# Altium project 16x16_BLE.PrjPcb
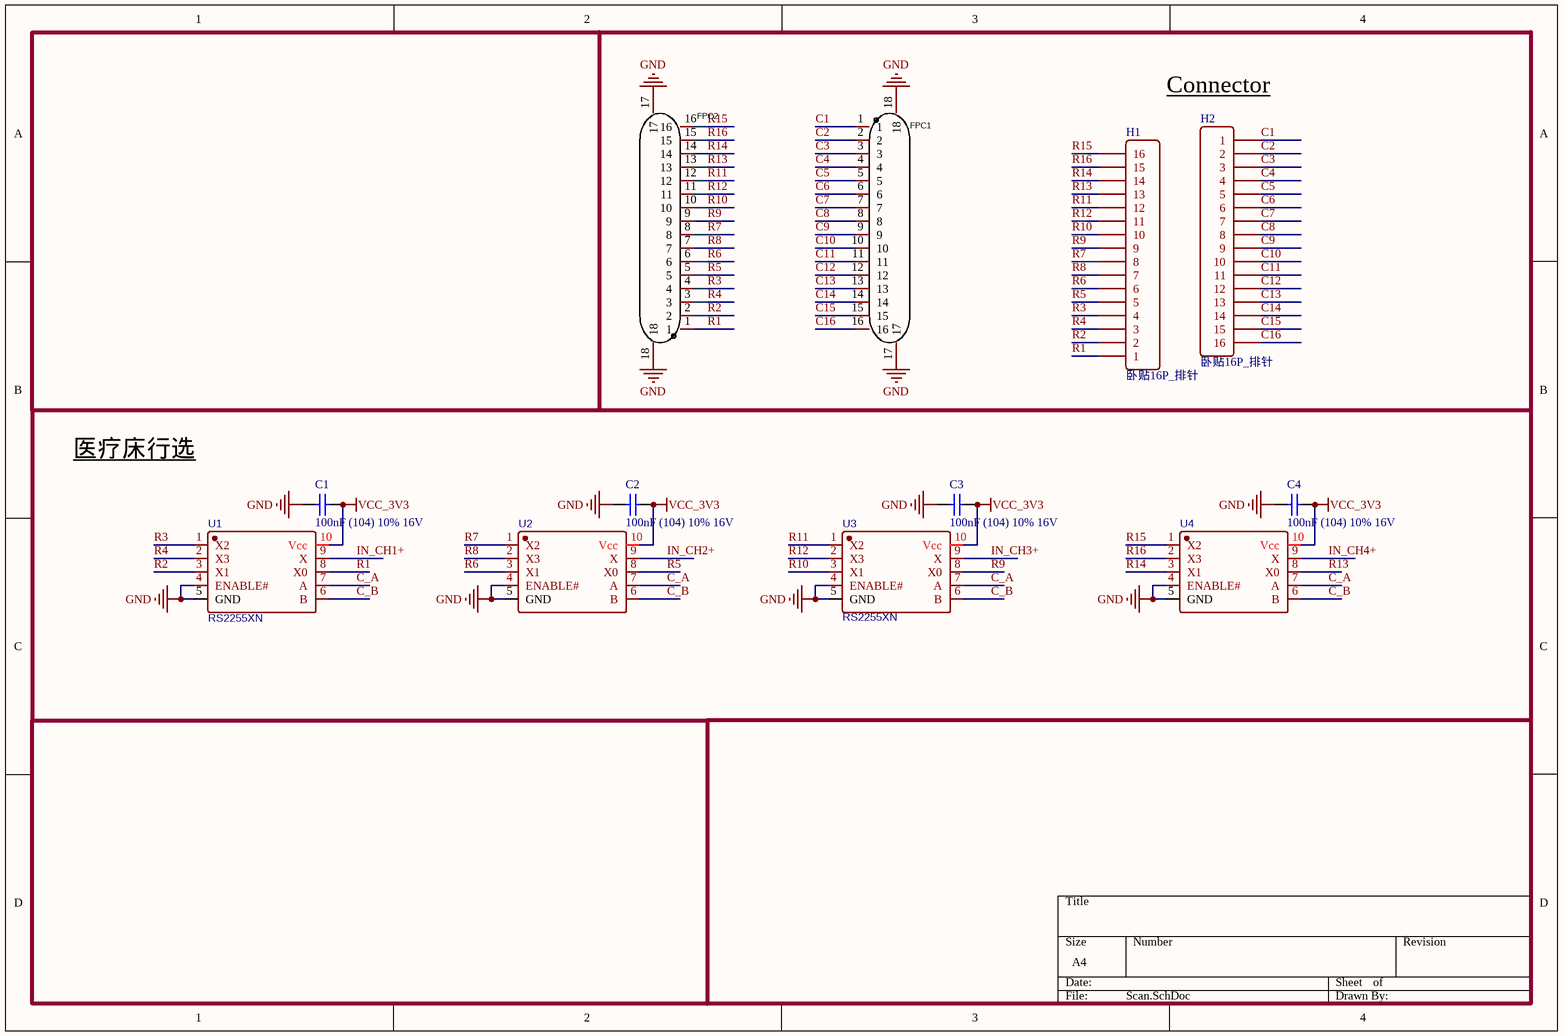
[diagram p0: Scan.SchDoc]
4 sheets, 101 parts. Net scope: global (net labels, ports and power ports of the same name join across sheets).
Board files: 16x16_ble.PcbDoc, 16X16_covert Board.PcbDoc
Sheets:
  Scan.SchDoc
  MCU.SchDoc
  Power.SchDoc
  Measure.SchDoc

## Sheet Scan.SchDoc
size A4

### Parts
C1  100nF (104) 10% 16V  [0402_C]
C2  100nF (104) 10% 16V  [0402_C]
C3  100nF (104) 10% 16V  [0402_C]
C4  100nF (104) 10% 16V  [0402_C]
FPC1  1.0K-FX-16PWB  [FPC-SMD_16P-P1.00-HDGC_1.0K-FX-16PWB]  (value not drawn)
FPC2  X10B25U16T  [FPC-SMD_X10B25U16T]  (value not drawn)
H1  卧贴16P_排针  [CONN-SMD_16PINS]
H2  卧贴16P_排针  [CONN-SMD_16PINS]
U1  RS2255XN  [MSOP-10_L3.0-W3.0-P0.50-LS5.0-BL]
U2  (no value)  [MSOP-10_L3.0-W3.0-P0.50-LS5.0-BL]
U3  RS2255XN  [MSOP-10_L3.0-W3.0-P0.50-LS5.0-BL]
U4  (no value)  [MSOP-10_L3.0-W3.0-P0.50-LS5.0-BL]

### Nets
GND: C1.2 C2.2 C3.2 C4.2 FPC1.17 FPC1.18 FPC2.17 FPC2.18 U1.4(ENABLE#) U1.5(GND) U2.4(ENABLE#) U2.5(GND) U3.4(ENABLE#) U3.5(GND) U4.4(ENABLE#) U4.5(GND)
VCC_3V3: C1.1 C2.1 C3.1 C4.1 U1.10(Vcc) U2.10(Vcc) U3.10(Vcc) U4.10(Vcc)
C1: FPC1.1 H2.1
C2: FPC1.2 H2.2
C3: FPC1.3 H2.3
C4: FPC1.4 H2.4
C5: FPC1.5 H2.5
C6: FPC1.6 H2.6
C7: FPC1.7 H2.7
C8: FPC1.8 H2.8
C9: FPC1.9 H2.9
C10: FPC1.10 H2.10
C11: FPC1.11 H2.11
C12: FPC1.12 H2.12
C13: FPC1.13 H2.13
C14: FPC1.14 H2.14
C15: FPC1.15 H2.15
C16: FPC1.16 H2.16
C_A: U1.7(A) U2.7(A) U3.7(A) U4.7(A)
C_B: U1.6(B) U2.6(B) U3.6(B) U4.6(B)
IN_CH1+: U1.9(X)
IN_CH2+: U2.9(X)
IN_CH3+: U3.9(X)
IN_CH4+: U4.9(X)
R1: FPC2.1 H1.1 U1.8(X0)
R2: FPC2.2 H1.2 U1.3(X1)
R3: FPC2.4 H1.4 U1.1(X2)
R4: FPC2.3 H1.3 U1.2(X3)
R5: FPC2.5 H1.5 U2.8(X0)
R6: FPC2.6 H1.6 U2.3(X1)
R7: FPC2.8 H1.8 U2.1(X2)
R8: FPC2.7 H1.7 U2.2(X3)
R9: FPC2.9 H1.9 U3.8(X0)
R10: FPC2.10 H1.10 U3.3(X1)
R11: FPC2.12 H1.12 U3.1(X2)
R12: FPC2.11 H1.11 U3.2(X3)
R13: FPC2.13 H1.13 U4.8(X0)
R14: FPC2.14 H1.14 U4.3(X1)
R15: FPC2.16 H1.16 U4.1(X2)
R16: FPC2.15 H1.15 U4.2(X3)

### Notes on the sheet
- (near H2) Connector
- 医疗床行选

### Library data of the parts
C1-C4 = 0402 100nF (104) 10% 16V: 贴片电容; ComponentLink1Description: 供应商链接; ComponentLink1URL: http://www.szlcsc.com/product/details_1877.html; Package: 0402; Supplier: LC; SuppliersPartNumber: C1525
FPC1 = FPC_16P_抽屉式下接: Manufacturer: HDGC(华德共创); Add into BOM: yes; Pitch: 1mm; Number of Contacts: 16; Locking Feature: 抽屉式; FFC, FCB Thickness: 0.3mm; Name: 1.0K-FX-16PWB; Symbol: 1.0K-FX-16PWB; Device: 1.0K-FX-16PWB; LCSC Part Name: 1mm P数:16 抽屉式 下接; Supplier Part: C2914075; Manufacturer Part: 1.0K-FX-16PWB; Supplier Footprint: SMD,P=1mm; JLCPCB Part Class: Extended Part; Datasheet: https://atta.szlcsc.com/upload/public/pdf/source/20211102/926C0C24B01018ECCB068402A8A27F57.pdf; Supplier: LCSC; Convert to PCB: yes; Mounting Type: 卧贴; Contact Type: 下接; Height Above Board: 2.5mm; Operating Temperature Range: -20℃~+85℃
FPC2 = FPC_16P_抽屉式上接: Manufacturer: XKB Connectivity(中国星坤); Add into BOM: yes; Pitch: 1mm; Number of Contacts: 16; Locking Feature: 抽屉式; FFC, FCB Thickness: 0.3mm; Welding Temperature (Max): 260℃; Name: X10B25U16T; Symbol: X10B25U16T; Device: X10B25U16T; LCSC Part Name: 1mm P数:16 抽屉式 上接 镀锡; Supplier Part: C500194; Manufacturer Part: X10B25U16T; Supplier Footprint: SMD,P=1mm; JLCPCB Part Class: Extended Part; Datasheet: https://atta.szlcsc.com/upload/public/pdf/source/20211011/E8BDE13A8FA62B089EE070F29D883999.pdf; Supplier: LCSC; Convert to PCB: yes; Mounting Type: 卧贴; Contact Type: 上接; Height Above Board: 2.5mm; Contact Material: 磷青铜; Contact Plating: 金; Operating Temperature Range: -40℃~+85℃
U1-U4 = RS2255XN: BOM_Manufacturer: Jiangsu RUNIC Tech; Contributor: LCSC; BOM_Supplier: LCSC; BOM_Supplier Part: C783421; BOM_Manufacturer Part: RS2255XN; BOM_JLCPCB Part Class: Extended Part; spicePre: U; spiceSymbolName: RS2255XN

## Sheet MCU.SchDoc
size A4
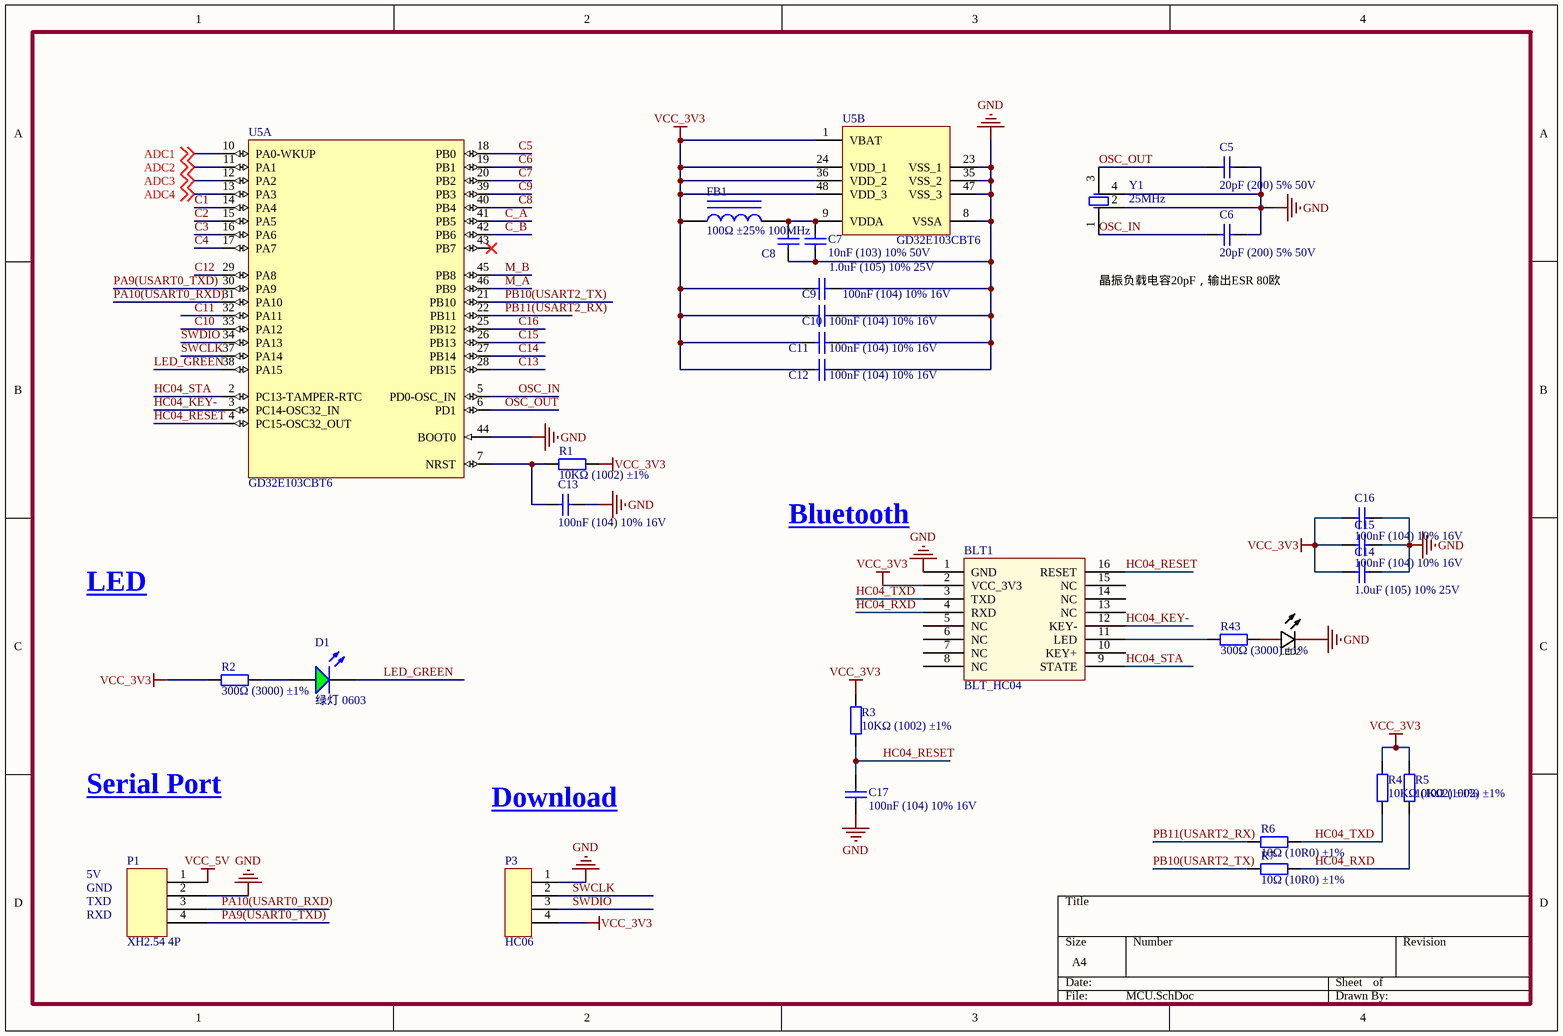
[diagram p1: MCU.SchDoc]

### Parts
BLT1  BLT_HC04  [HC04_BLT]
C5  20pF (200) 5% 50V  [0402_C]
C6  20pF (200) 5% 50V  [0402_C]
C7  10nF (103) 10% 50V  [0402_C]
C8  1.0uF (105) 10% 25V  [0402_C]
C9  100nF (104) 10% 16V  [0402_C]
C10  100nF (104) 10% 16V  [0402_C]
C11  100nF (104) 10% 16V  [0402_C]
C12  100nF (104) 10% 16V  [0402_C]
C13  100nF (104) 10% 16V  [0402_C]
C14  1.0uF (105) 10% 25V  [0402_C]
C15  100nF (104) 10% 16V  [0402_C]
C16  100nF (104) 10% 16V  [0402_C]
C17  100nF (104) 10% 16V  [0402_C]
D1  绿灯 0603  [0603_LED_S1]
FB1  100Ω ±25% 100MHz  [0805_L]
LED2  0603  [LED0603-RD]  (value not drawn)
P1  XH2.54 4P  [HC06]
P3  HC06  [HC06]
R1  10KΩ (1002) ±1%  [0402_R]
R2  300Ω (3000) ±1%  [0402_R]
R3  10KΩ (1002) ±1%  [0402_R]
R4  10KΩ (1002) ±1%  [0402_R]
R5  10KΩ (1002) ±1%  [0402_R]
R6  10Ω (10R0) ±1%  [0402_R]
R7  10Ω (10R0) ±1%  [0402_R]
R43  300Ω (3000) ±1%  [0402_R]
U5  GD32E103CBT6  [LQFP48_N]  (parts A,B of 2)
Y1  25MHz  [3225]

### Nets
GND: BLT1.1(GND) C5.2 C6.2 C7.1 C8.2 C9.2 C10.2 C11.2 C12.2 C13.2 C14.1 C15.1 C16.1 C17.1 LED2.2(K) P1.2 P3.1 U5.8(VSSA) U5.23(VSS_1) U5.35(VSS_2) U5.44(BOOT0) U5.47(VSS_3) Y1.2(HIN4) Y1.4(HIN4)
VCC_3V3: BLT1.2(VCC_3V3) C9.1 C10.1 C11.1 C12.1 C14.2 C15.2 C16.2 FB1.1 P3.4 R1.2 R2.1 R3.2 R4.2 R5.2 U5.1(VBAT) U5.24(VDD_1) U5.36(VDD_2) U5.48(VDD_3)
VCC_5V: P1.1
ADC1: U5.10(PA0-WKUP) ; off-sheet ADC1
ADC2: U5.11(PA1) ; off-sheet ADC2
ADC3: U5.12(PA2) ; off-sheet ADC3
ADC4: U5.13(PA3) ; off-sheet ADC4
C1: U5.14(PA4)
C2: U5.15(PA5)
C3: U5.16(PA6)
C4: U5.17(PA7)
C5: U5.18(PB0)
C6: U5.19(PB1)
C7: U5.20(PB2)
C8: U5.40(PB4)
C9: U5.39(PB3)
C10: U5.33(PA12)
C11: U5.32(PA11)
C12: U5.29(PA8)
C13: U5.28(PB15)
C14: U5.27(PB14)
C15: U5.26(PB13)
C16: U5.25(PB12)
C_A: U5.41(PB5)
C_B: U5.42(PB6)
HC04_KEY-: BLT1.12(KEY-) U5.3(PC14-OSC32_IN)
HC04_RESET: BLT1.16(RESET) C17.2 R3.1 U5.4(PC15-OSC32_OUT)
HC04_RXD: BLT1.4(RXD) R5.1 R7.2
HC04_STA: BLT1.9(STATE) U5.2(PC13-TAMPER-RTC)
HC04_TXD: BLT1.3(TXD) R4.1 R6.2
LED_GREEN: D1.K U5.38(PA15)
M_A: U5.46(PB9)
M_B: U5.45(PB8)
OSC_IN: C6.1 U5.5(PD0-OSC_IN) Y1.1(OSC2)
OSC_OUT: C5.1 U5.6(PD1) Y1.3(OSC1)
PA9(USART0_TXD): P1.4 U5.30(PA9)
PA10(USART0_RXD): P1.3 U5.31(PA10)
PB10(USART2_TX): R7.1 U5.21(PB10)
PB11(USART2_RX): R6.1 U5.22(PB11)
SWCLK: P3.2 U5.37(PA14)
SWDIO: P3.3 U5.34(PA13)
NetBLT1_11: BLT1.11(LED) R43.2
NetC7_2: C7.2 C8.1 FB1.2 U5.9(VDDA)
NetC13_1: C13.1 R1.1 U5.7(NRST)
NetD1_A: D1.A R2.2
NetLED2_1: LED2.1(A) R43.1

Not connected (* = marked no-connect by the designer): BLT1 5(NC) 6(NC) 7(NC) 8(NC) 10(KEY+) 13(NC) 14(NC) 15(NC); U5 43(PB7)*

### Notes on the sheet
- (near C6) 晶振负载电容20pF，输出ESR 80欧
- Bluetooth
- LED
- Serial Port
- Download
- 5V
- GND
- TXD
- RXD

### Library data of the parts
C5 C6 = 0402 20pF (200) 5% 50V: 贴片电容; ComponentLink1Description: 供应商链接; ComponentLink1URL: http://www.szlcsc.com/product/details_1906.html; Package: 0402; Supplier: LC; SuppliersPartNumber: C1554
C7 = 0402 10nF (103) 10% 50V: 贴片电容; ComponentLink1Description: 供应商链接; ComponentLink1URL: http://www.szlcsc.com/product/details_15869.html; Package: 0402; Supplier: LC; SuppliersPartNumber: C15195
C8-C12 = 0402-C: 贴片电容
C13 C15-C17 = 0402 100nF (104) 10% 16V: 贴片电容; ComponentLink1Description: 供应商链接; ComponentLink1URL: http://www.szlcsc.com/product/details_1877.html; Package: 0402; Supplier: LC; SuppliersPartNumber: C1525
C14 = 0402 1.0uF (105) 10% 25V: 贴片电容; ComponentLink1Description: 供应商链接; ComponentLink1URL: http://www.szlcsc.com/product/details_53938.html; Package: 0402; Supplier: LC; SuppliersPartNumber: C52923
D1 = 0603 绿灯: 发光二极管; ComponentLink1Description: 供应商链接; ComponentLink1URL: http://www.szlcsc.com/product/details_73152.html; Package: 0603; Supplier: LC; SuppliersPartNumber: C72043
FB1 = 0805 100Ω 25% 100MHz: 贴片磁珠; ComponentLink1Description: 供应商链接; ComponentLink1URL: http://www.szlcsc.com/product/details_1367.html; Package: 0805; Supplier: LC; SuppliersPartNumber: C1015
LED2 = 0603 LED 蓝: Manufacturer: 国星光电; Name: NCD0603B4; Symbol: FC-F1608BK-470H5; Add into BOM: yes; Emitted Color: 蓝灯; Device: NCD0603B4; LCSC Part Name: 蓝灯; Supplier Part: C89814; Manufacturer Part: NCD0603B4; Supplier Footprint: 0603; JLCPCB Part Class: Extended Part; Datasheet: https://atta.szlcsc.com/upload/public/pdf/source/20200820/C89814_3D11357C976AB31B19046E836063F91D.pdf; Supplier: LCSC; Convert to PCB: yes
R1 R3-R5 = 0402 10KΩ (1002) 1%: 贴片电阻; ComponentLink1Description: 供应商链接; ComponentLink1URL: http://www.szlcsc.com/product/details_26487.html; Package: 0402; Supplier: LC; SuppliersPartNumber: C25744
R2 R43 = 0402 300Ω (3000) 1%: 贴片电阻; ComponentLink1Description: 供应商链接; ComponentLink1URL: http://www.szlcsc.com/product/details_25845.html; Package: 0402; Supplier: LC; SuppliersPartNumber: C25102
R6 R7 = 0402 10Ω (10R0) 1%: 贴片电阻; ComponentLink1Description: 供应商链接; ComponentLink1URL: http://www.szlcsc.com/product/details_25820.html; Package: 0402; Supplier: LC; SuppliersPartNumber: C25077
Y1 = XTAL-4: Crystal Oscillator; Published: 8-Jun-2000; LatestRevisionDate: 17-Jul-2002; LatestRevisionNote: Re-released for DXP Platform.; PackageReference: R38; Publisher: Altium Limited; PackageDescription: Crystal, Thru-Hole; 2 Leads; Body 3.1 x 8.2 mm (Dia.xH)
U5 = GD32E103CBT6: DatasheetVersion: rev13.0, Apr-2011; PackageVersion: rev13, Apr-2011; PackageReference: LQFP48; PackageDescription: 48-Pin Low-Profile Quad Flat Pack, 7 x 7 mm Body, 0.5 mm Pitch (LQFP48); ComponentLink1Description: Manufacturer URL; ComponentLink1URL: http://www.st.com/; ComponentLink2Description: STM32F103 Datasheet; ComponentLink2URL: http://www.st.com/internet/com/TECHNICAL_RESOURCES/TECHNICAL_LITERATURE/DATASHEET/CD00161566.pdf; ComponentLink3Description: STM32 Family Web Page; ComponentLink3URL: www.st.com/stm32

## Sheet Power.SchDoc
size A4
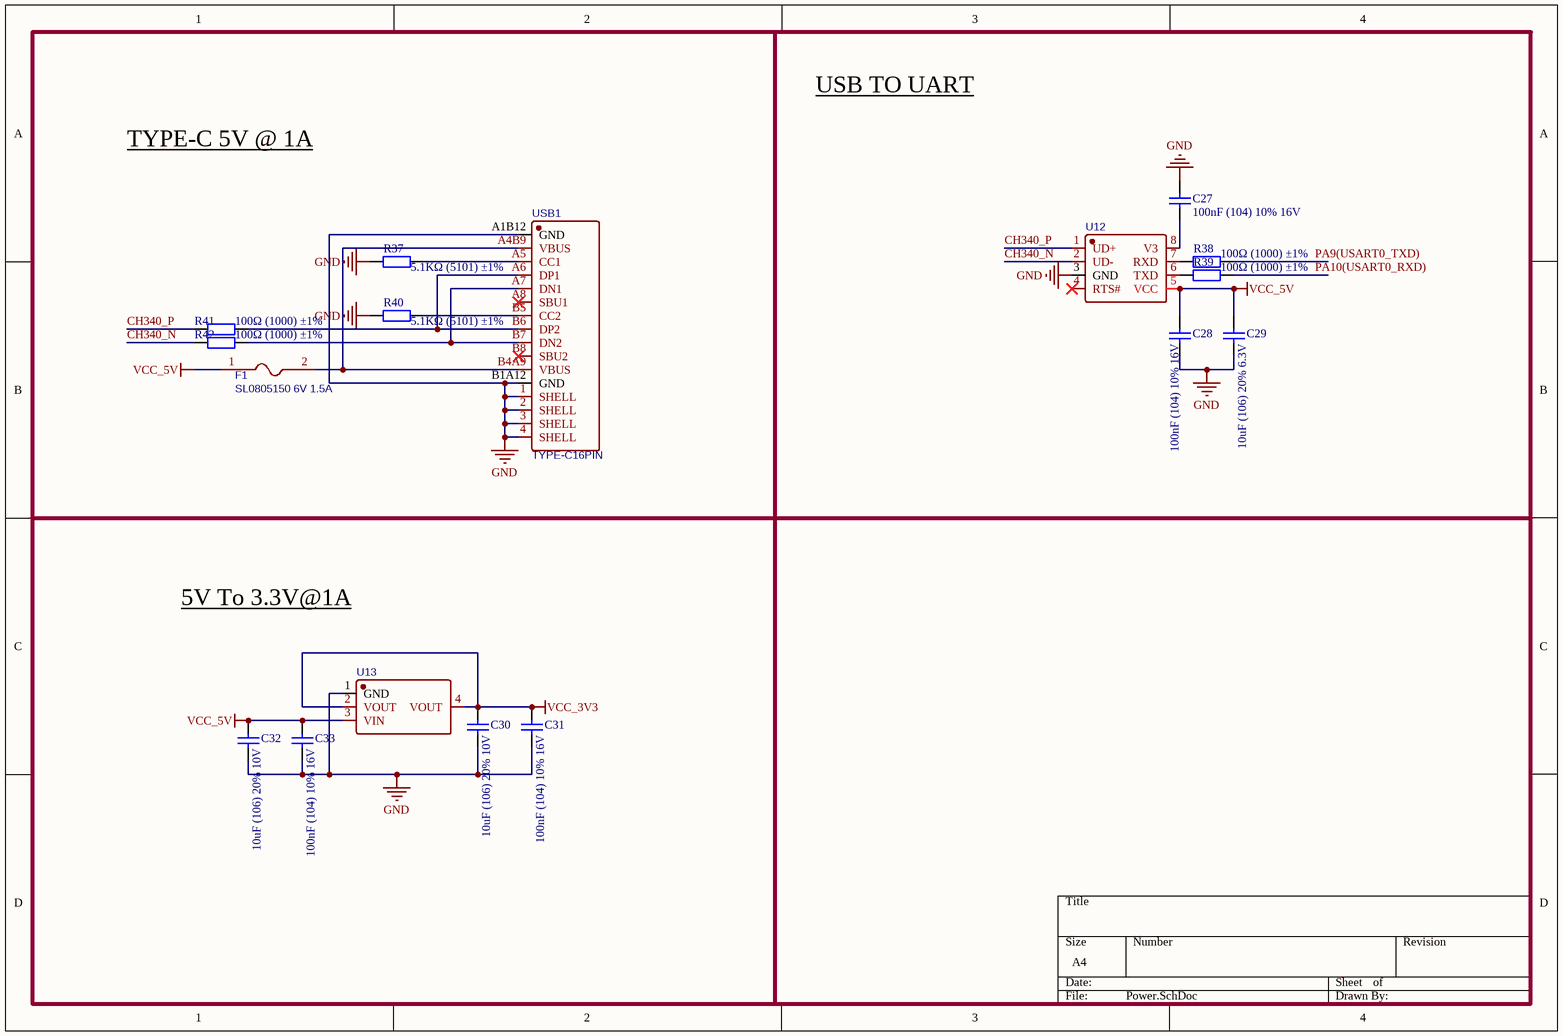
[diagram p2: Power.SchDoc]

### Parts
C27  100nF (104) 10% 16V  [0402_C]
C28  100nF (104) 10% 16V  [0402_C]
C29  10uF (106) 20% 6.3V  [0402_C]
C30  10uF (106) 20% 10V  [0402_C]
C31  100nF (104) 10% 16V  [0402_C]
C32  10uF (106) 20% 10V  [0402_C]
C33  100nF (104) 10% 16V  [0402_C]
F1  SL0805150 6V 1.5A  [F0805]
R37  5.1KΩ (5101) ±1%  [0402_R]
R38  100Ω (1000) ±1%  [0402_R]
R39  100Ω (1000) ±1%  [0402_R]
R40  5.1KΩ (5101) ±1%  [0402_R]
R41  100Ω (1000) ±1%  [0402_R]
R42  100Ω (1000) ±1%  [0402_R]
U12  (no value)  [SOP-8_L5.0-W4.0-P1.27-LS6.0-BL]
U13  (no value)  [SOT-223-3_L6.5-W3.4-P2.30-LS7.0-BR]
USB1  TYPE-C16PIN  [USB-C-SMD_TYPE-C16PIN]

### Nets
GND: C27.2 C28.1 C29.1 C30.1 C31.1 C32.1 C33.1 R37.2 R40.2 U12.3(GND) U13.1(GND) USB1.1(SHELL) USB1.2(SHELL) USB1.3(SHELL) USB1.4(SHELL) USB1.A1B12(GND) USB1.B1A12(GND)
VCC_3V3: C30.2 C31.2 U13.2(VOUT) U13.4(VOUT)
VCC_5V: C28.2 C29.2 C32.2 C33.2 F1.1 U12.5(VCC) U13.3(VIN)
CH340_N: R42.1 U12.2(UD-)
CH340_P: R41.1 U12.1(UD+)
PA9(USART0_TXD): R38.2
PA10(USART0_RXD): R39.2
NetC27_1: C27.1 U12.8(V3)
NetF1_2: F1.2 USB1.A4B9(VBUS) USB1.B4A9(VBUS)
NetR37_1: R37.1 USB1.A5(CC1)
NetR38_1: R38.1 U12.7(RXD)
NetR39_1: R39.1 U12.6(TXD)
NetR40_1: R40.1 USB1.B5(CC2)
NetR41_2: R41.2 USB1.A6(DP1) USB1.B6(DP2)
NetR42_2: R42.2 USB1.A7(DN1) USB1.B7(DN2)

Not connected (* = marked no-connect by the designer): U12 4(RTS#)*; USB1 A8(SBU1)* B8(SBU2)*

### Notes on the sheet
- USB TO UART
- TYPE-C 5V @ 1A
- 5V To 3.3V@1A

### Library data of the parts
C27 C28 C31 C33 = 0402 100nF (104) 10% 16V: 贴片电容; ComponentLink1Description: 供应商链接; ComponentLink1URL: http://www.szlcsc.com/product/details_1877.html; Package: 0402; Supplier: LC; SuppliersPartNumber: C1525
C29 C30 C32 = 0402 10uF (106) 20% 6.3V: 贴片电容; ComponentLink1Description: 供应商链接; ComponentLink1URL: http://www.szlcsc.com/product/details_16204.html; Package: 0402; Supplier: LC; SuppliersPartNumber: C15525
F1 = SL0805150: BOM_Manufacturer: TECHFUSE; BOM_Supplier: LCSC; BOM_Manufacturer Part: SL0805150; BOM_Supplier Part: C70156; BOM_JLCPCB Part Class: Extended Part; spicePre: F; spiceSymbolName: SL0805150
R37 R40 = 0402 5.1KΩ (5101) 1%: 贴片电阻; ComponentLink1Description: 供应商链接; ComponentLink1URL: http://www.szlcsc.com/product/details_26648.html; Package: 0402; Supplier: LC; SuppliersPartNumber: C25905
R38 R39 R41 R42 = 0402 100Ω (1000) 1%: 贴片电阻; ComponentLink1Description: 供应商链接; ComponentLink1URL: http://www.szlcsc.com/product/details_25819.html; Package: 0402; Supplier: LC; SuppliersPartNumber: C25076
U12 = CH340N: BOM_Manufacturer: WCH(Jiangsu Qin Heng); Contributor: LCSC; BOM_Supplier: LCSC; BOM_Supplier Part: C506813; BOM_Manufacturer Part: CH340N; BOM_JLCPCB Part Class: Extended Part; spicePre: U; spiceSymbolName: CH340N
U13 = AMS1117-3.3V: BOM_Manufacturer: FM; BOM_Manufacturer Part: SC1117-3.3V; Contributor: LCSC; BOM_Supplier: LCSC; BOM_Supplier Part: C173386; BOM_JLCPCB Part Class: Extended Part; spicePre: U; spiceSymbolName: SC1117-3.3V
USB1 = TYPE-C16PIN: BOM_Manufacturer: SHOU HAN; Contributor: LCSC; BOM_Supplier: LCSC; BOM_Supplier Part: C393939; BOM_Manufacturer Part: TYPE-C16PIN; BOM_JLCPCB Part Class: Extended Part; spicePre: U; spiceSymbolName: TYPE-C16PIN

## Sheet Measure.SchDoc
size A4
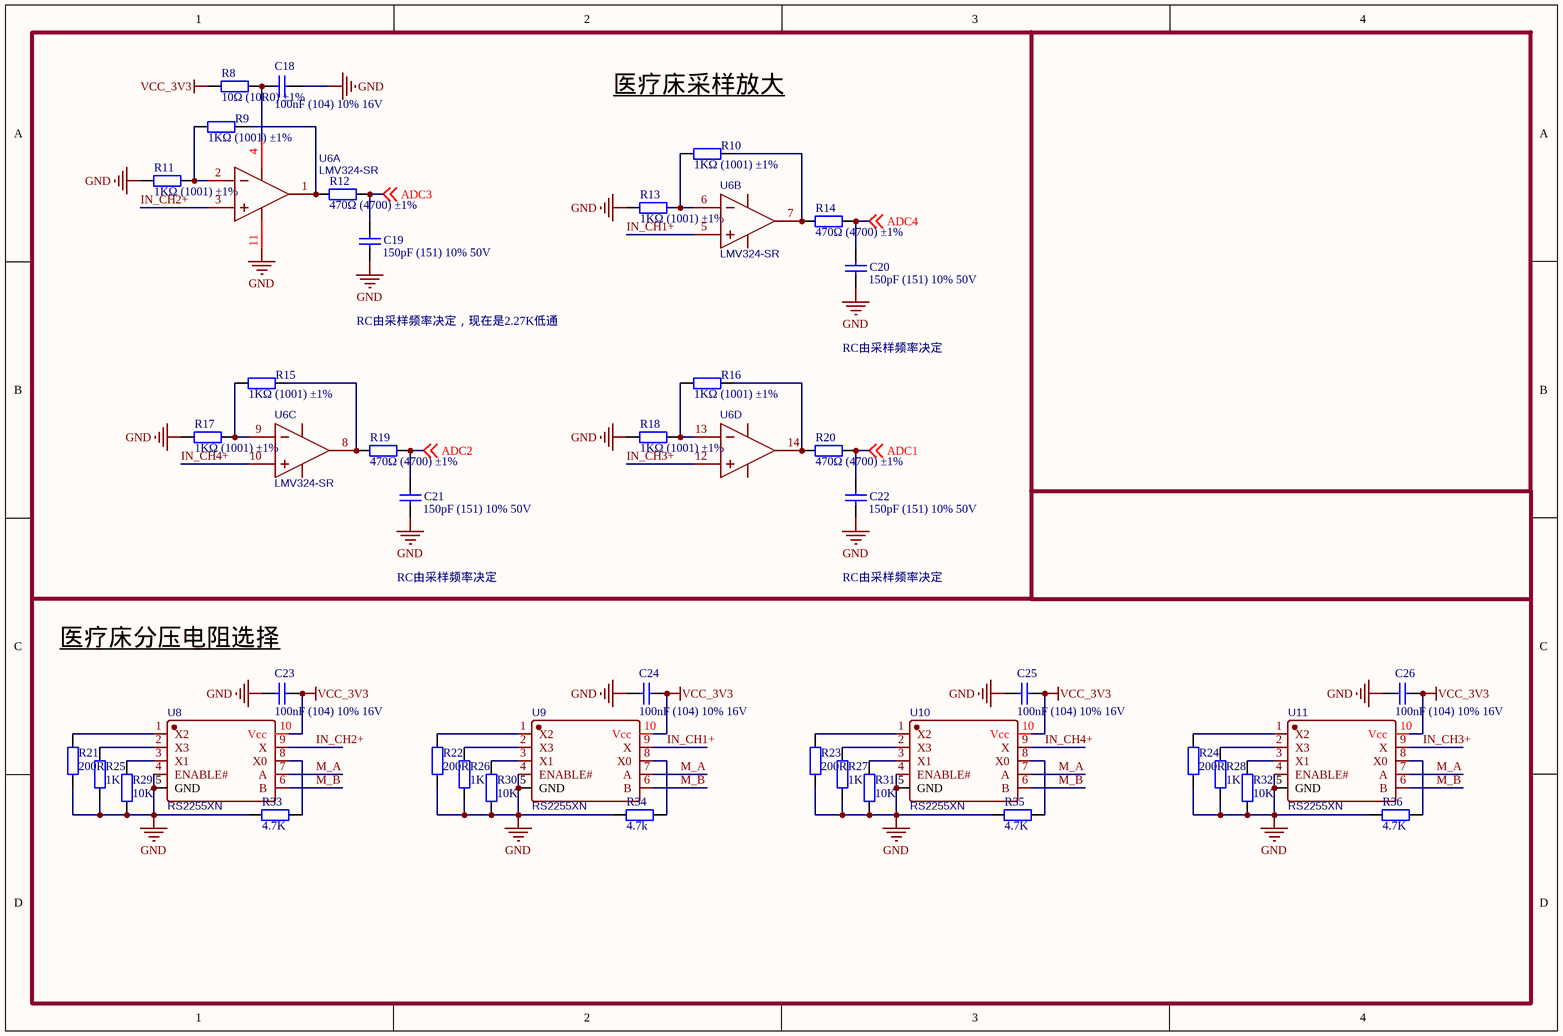
[diagram p3: Measure.SchDoc]

### Parts
C18  100nF (104) 10% 16V  [0402_C]
C19  150pF (151) 10% 50V  [0402_C]
C20  150pF (151) 10% 50V  [0402_C]
C21  150pF (151) 10% 50V  [0402_C]
C22  150pF (151) 10% 50V  [0402_C]
C23  100nF (104) 10% 16V  [0402_C]
C24  100nF (104) 10% 16V  [0402_C]
C25  100nF (104) 10% 16V  [0402_C]
C26  100nF (104) 10% 16V  [0402_C]
R8  10Ω (10R0) ±1%  [0402_R]
R9  1KΩ (1001) ±1%  [0402_R]
R10  1KΩ (1001) ±1%  [0402_R]
R11  1KΩ (1001) ±1%  [0402_R]
R12  470Ω (4700) ±1%  [0402_R]
R13  1KΩ (1001) ±1%  [0402_R]
R14  470Ω (4700) ±1%  [0402_R]
R15  1KΩ (1001) ±1%  [0402_R]
R16  1KΩ (1001) ±1%  [0402_R]
R17  1KΩ (1001) ±1%  [0402_R]
R18  1KΩ (1001) ±1%  [0402_R]
R19  470Ω (4700) ±1%  [0402_R]
R20  470Ω (4700) ±1%  [0402_R]
R21  200R  [0402_R]
R22  200R  [0402_R]
R23  200R  [0402_R]
R24  200R  [0402_R]
R25  1K  [0402_R]
R26  1K  [0402_R]
R27  1K  [0402_R]
R28  1K  [0402_R]
R29  10K  [0402_R]
R30  10K  [0402_R]
R31  10K  [0402_R]
R32  10K  [0402_R]
R33  4.7K  [0402_R]
R34  4.7k  [0402_R]
R35  4.7K  [0402_R]
R36  4.7K  [0402_R]
U6  LMV324-SR  [SOP-14_L8.6-W3.9-P1.27-LS6.0-BL]  (parts A,B,C,D of 4)
U8  RS2255XN  [MSOP-10_L3.0-W3.0-P0.50-LS5.0-BL]
U9  RS2255XN  [MSOP-10_L3.0-W3.0-P0.50-LS5.0-BL]
U10  RS2255XN  [MSOP-10_L3.0-W3.0-P0.50-LS5.0-BL]
U11  RS2255XN  [MSOP-10_L3.0-W3.0-P0.50-LS5.0-BL]

### Nets
GND: C18.2 C19.1 C20.1 C21.1 C22.1 C23.2 C24.2 C25.2 C26.2 R11.1 R13.1 R17.1 R18.1 R21.1 R22.1 R23.1 R24.1 R25.2 R26.2 R27.2 R28.2 R29.2 R30.2 R31.2 R32.2 R33.2 R34.2 R35.2 R36.2 U6.11(GND) U8.4(ENABLE#) U8.5(GND) U9.4(ENABLE#) U9.5(GND) U10.4(ENABLE#) U10.5(GND) U11.4(ENABLE#) U11.5(GND)
VCC_3V3: C23.1 C24.1 C25.1 C26.1 R8.1 U8.10(Vcc) U9.10(Vcc) U10.10(Vcc) U11.10(Vcc)
ADC1: C22.2 R20.2 ; off-sheet ADC1
ADC2: C21.2 R19.2 ; off-sheet ADC2
ADC3: C19.2 R12.2 ; off-sheet ADC3
ADC4: C20.2 R14.2 ; off-sheet ADC4
IN_CH1+: U6.5(2IN+) U9.9(X)
IN_CH2+: U6.3(1IN+) U8.9(X)
IN_CH3+: U6.12(4IN+) U11.9(X)
IN_CH4+: U6.10(3IN+) U10.9(X)
M_A: U8.7(A) U9.7(A) U10.7(A) U11.7(A)
M_B: U8.6(B) U9.6(B) U10.6(B) U11.6(B)
NetC18_1: C18.1 R8.2 U6.4(VCC)
NetR9_1: R9.1 R11.2 U6.2(1IN-)
NetR9_2: R9.2 R12.1 U6.1(1OUT)
NetR10_1: R10.1 R13.2 U6.6(2IN-)
NetR10_2: R10.2 R14.1 U6.7(2OUT)
NetR15_1: R15.1 R17.2 U6.9(3IN-)
NetR15_2: R15.2 R19.1 U6.8(3OUT)
NetR16_1: R16.1 R18.2 U6.13(4IN-)
NetR16_2: R16.2 R20.1 U6.14(4OUT)
NetR21_2: R21.2 U8.1(X2)
NetR22_2: R22.2 U9.1(X2)
NetR23_2: R23.2 U10.1(X2)
NetR24_2: R24.2 U11.1(X2)
NetR25_1: R25.1 U8.2(X3)
NetR26_1: R26.1 U9.2(X3)
NetR27_1: R27.1 U10.2(X3)
NetR28_1: R28.1 U11.2(X3)
NetR29_1: R29.1 U8.3(X1)
NetR30_1: R30.1 U9.3(X1)
NetR31_1: R31.1 U10.3(X1)
NetR32_1: R32.1 U11.3(X1)
NetR33_1: R33.1 U8.8(X0)
NetR34_1: R34.1 U9.8(X0)
NetR35_1: R35.1 U10.8(X0)
NetR36_1: R36.1 U11.8(X0)

### Notes on the sheet
- 医疗床采样放大
- RC由采样频率决定，现在是2.27K低通
- RC由采样频率决定
- 医疗床分压电阻选择

### Library data of the parts
C18 C23-C26 = 0402 100nF (104) 10% 16V: 贴片电容; ComponentLink1Description: 供应商链接; ComponentLink1URL: http://www.szlcsc.com/product/details_1877.html; Package: 0402; Supplier: LC; SuppliersPartNumber: C1525
C19-C22 = 0402 150pF (151) 10% 50V: 贴片电容; ComponentLink1Description: 供应商链接; ComponentLink1URL: http://www.szlcsc.com/product/details_1879.html; Package: 0402; Supplier: LC; SuppliersPartNumber: C1527
R8 = 0402 10Ω (10R0) 1%: 贴片电阻; ComponentLink1Description: 供应商链接; ComponentLink1URL: http://www.szlcsc.com/product/details_25820.html; Package: 0402; Supplier: LC; SuppliersPartNumber: C25077
R9-R11 R13 R15-R18 R25-R28 = 0402 1KΩ (1001) 1%: 贴片电阻; ComponentLink1Description: 供应商链接; ComponentLink1URL: http://www.szlcsc.com/product/details_12256.html; Package: 0402; Supplier: LC; SuppliersPartNumber: C11702
R12 R14 R19 R20 = 0402 470Ω (4700) 1%: 贴片电阻; ComponentLink1Description: 供应商链接; ComponentLink1URL: http://www.szlcsc.com/product/details_25860.html; Package: 0402; Supplier: LC; SuppliersPartNumber: C25117
R21-R24 = 0402 200Ω (2000) 1%: 贴片电阻; ComponentLink1Description: 供应商链接; ComponentLink1URL: http://www.szlcsc.com/product/details_25830.html; Package: 0402; Supplier: LC; SuppliersPartNumber: C25087
R29-R32 = 0402 10KΩ (1002) 1%: 贴片电阻; ComponentLink1Description: 供应商链接; ComponentLink1URL: http://www.szlcsc.com/product/details_26487.html; Package: 0402; Supplier: LC; SuppliersPartNumber: C25744
R33-R36 = 0402 4.7KΩ (4701) 1%: 贴片电阻; ComponentLink1Description: 供应商链接; ComponentLink1URL: http://www.szlcsc.com/product/details_26643.html; Package: 0402; Supplier: LC; SuppliersPartNumber: C25900
U6 = LMV324-SR: BOM_Manufacturer: IDCHIP; BOM_Manufacturer Part: LMV324; subpart_no: 3; BOM_Supplier: LCSC; BOM_Supplier Part: C395458; BOM_JLCPCB Part Class: Extended Part; spicePre: U; spiceSymbolName: LMV324
U8-U11 = RS2255XN: as U1 on sheet Scan; BOM_Supplier: LCSC; BOM_Supplier Part: C783421; BOM_Manufacturer Part: RS2255XN; BOM_JLCPCB Part Class: Extended Part; spicePre: U; spiceSymbolName: RS2255XN

## Nets that join several sheets
GND: Scan (16 pins), MCU (24 pins), Power (17 pins), Measure (38 pins)
VCC_3V3: Scan (8 pins), MCU (19 pins), Power (C30.2 C31.2 U13.2 U13.4), Measure (9 pins)
VCC_5V: MCU (P1.1), Power (7 pins)
ADC1: MCU (U5.10), Measure (C22.2 R20.2)
ADC2: MCU (U5.11), Measure (C21.2 R19.2)
ADC3: MCU (U5.12), Measure (C19.2 R12.2)
ADC4: MCU (U5.13), Measure (C20.2 R14.2)
C1: Scan (FPC1.1 H2.1), MCU (U5.14)
C2: Scan (FPC1.2 H2.2), MCU (U5.15)
C3: Scan (FPC1.3 H2.3), MCU (U5.16)
C4: Scan (FPC1.4 H2.4), MCU (U5.17)
C5: Scan (FPC1.5 H2.5), MCU (U5.18)
C6: Scan (FPC1.6 H2.6), MCU (U5.19)
C7: Scan (FPC1.7 H2.7), MCU (U5.20)
C8: Scan (FPC1.8 H2.8), MCU (U5.40)
C9: Scan (FPC1.9 H2.9), MCU (U5.39)
C10: Scan (FPC1.10 H2.10), MCU (U5.33)
C11: Scan (FPC1.11 H2.11), MCU (U5.32)
C12: Scan (FPC1.12 H2.12), MCU (U5.29)
C13: Scan (FPC1.13 H2.13), MCU (U5.28)
C14: Scan (FPC1.14 H2.14), MCU (U5.27)
C15: Scan (FPC1.15 H2.15), MCU (U5.26)
C16: Scan (FPC1.16 H2.16), MCU (U5.25)
C_A: Scan (U1.7 U2.7 U3.7 U4.7), MCU (U5.41)
C_B: Scan (U1.6 U2.6 U3.6 U4.6), MCU (U5.42)
IN_CH1+: Scan (U1.9), Measure (U6.5 U9.9)
IN_CH2+: Scan (U2.9), Measure (U6.3 U8.9)
IN_CH3+: Scan (U3.9), Measure (U6.12 U11.9)
IN_CH4+: Scan (U4.9), Measure (U6.10 U10.9)
M_A: MCU (U5.46), Measure (U8.7 U9.7 U10.7 U11.7)
M_B: MCU (U5.45), Measure (U8.6 U9.6 U10.6 U11.6)
PA9(USART0_TXD): MCU (P1.4 U5.30), Power (R38.2)
PA10(USART0_RXD): MCU (P1.3 U5.31), Power (R39.2)